# Altium schematic sheet MCU.SchDoc
size A4; SheetNumber: 2; SheetTotal: 5
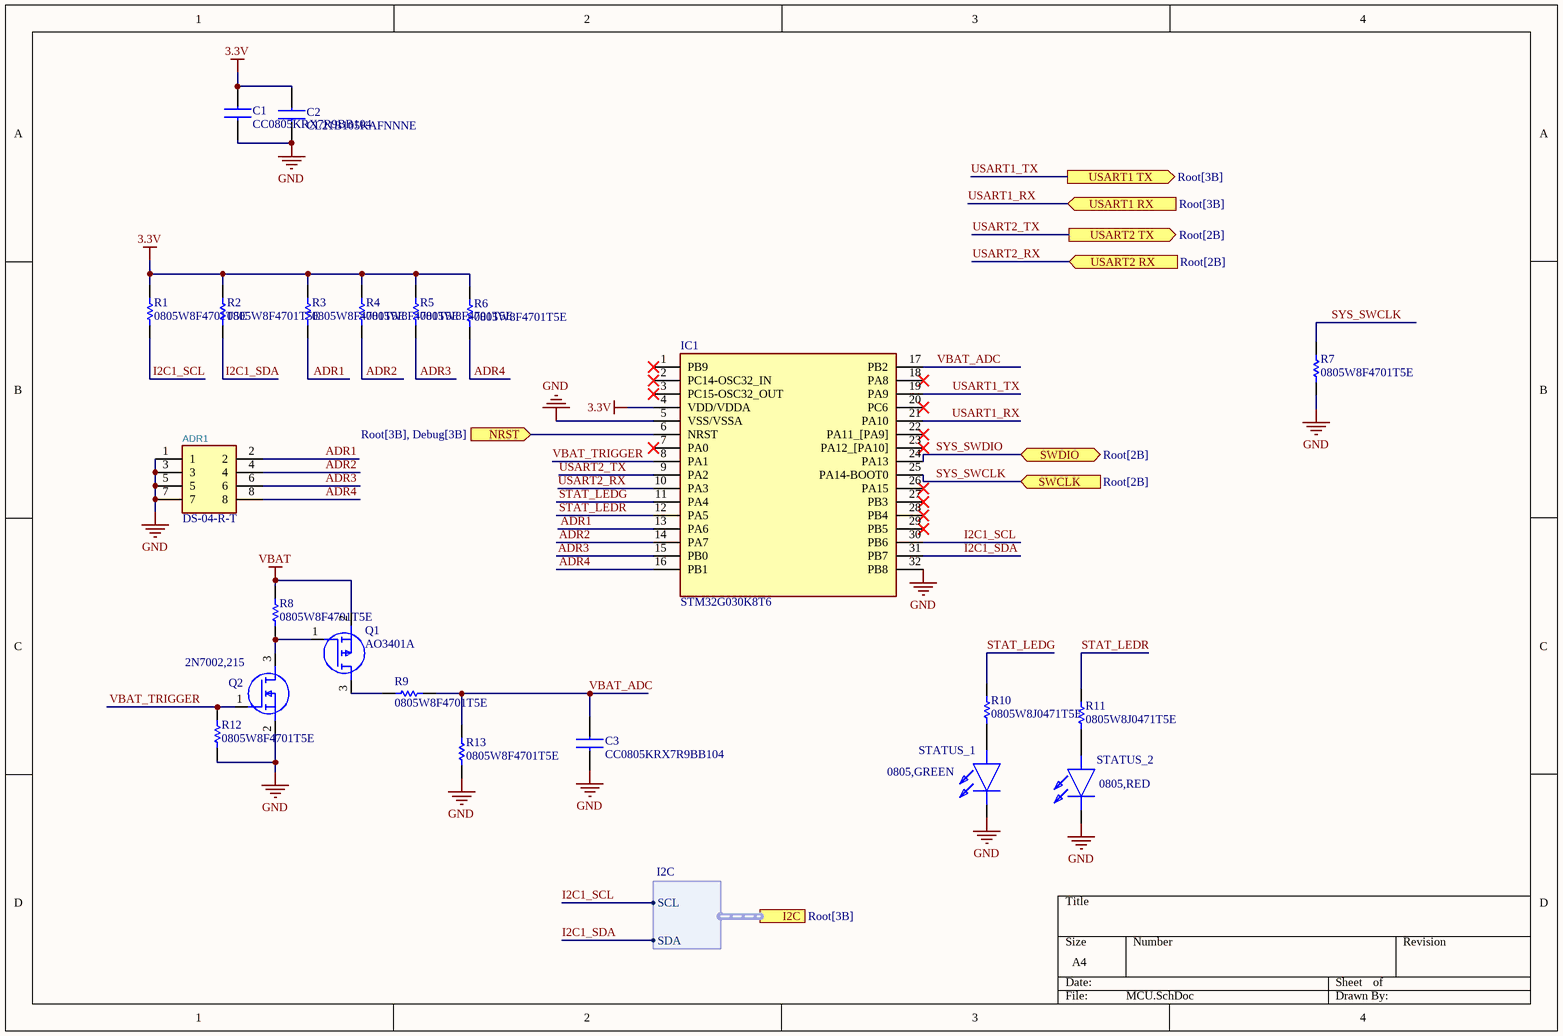
[diagram p0: MCU.SchDoc]

## Parts
ADR1  DS-04-R-T  [DS-04-R-T]
C1  CC0805KRX7R9BB104  [CAPC2012X95N]
C2  CL21B105KAFNNNE  [CAPC2012X135N]
C3  CC0805KRX7R9BB104  [CAPC2012X95N]
IC1  STM32G030K8T6  [QFP80P900X900X160-32N]
Q1  AO3401A  [SOT95P280X125-3N - duplicate]
Q2  2N7002,215  [SOT95P230X110-3N]
R1  0805W8F4701T5E  [RESC2013X65N]
R2  0805W8F4701T5E  [RESC2013X65N]
R3  0805W8F4701T5E  [RESC2013X65N]
R4  0805W8F4701T5E  [RESC2013X65N]
R5  0805W8F4701T5E  [RESC2013X65N]
R6  0805W8F4701T5E  [RESC2013X65N]
R7  0805W8F4701T5E  [RESC2013X65N]
R8  0805W8F4701T5E  [RESC2013X65N]
R9  0805W8F4701T5E  [RESC2013X65N]
R10  0805W8J0471T5E  [RESC2013X65N - Duplicate]
R11  0805W8J0471T5E  [RESC2013X65N - Duplicate]
R12  0805W8F4701T5E  [RESC2013X65N]
R13  0805W8F4701T5E  [RESC2013X65N]
STATUS_1  0805,GREEN  [LEDC2012X120N]
STATUS_2  0805,RED  [LEDC2012X120N - Duplicate]

## Ports
I2C (harness I2C, see Root[3B]), NRST (in, see Root[3B], Debug[3B]), SWCLK (in, see Root[2B]), SWDIO (bidir, see Root[2B]), USART1 RX (in, see Root[3B]), USART1 TX (out, see Root[3B]), USART2 RX (in, see Root[2B]), USART2 TX (out, see Root[2B])

## Harnesses
I2C: SCL, SDA

## Nets
3.3V: C1.2 C2.1 IC1.4(VDD/VDDA) R1.2 R2.2 R3.2 R4.2 R5.2 R6.2
GND: ADR1.1 ADR1.3 ADR1.5 ADR1.7 C1.1 C2.2 C3.1 IC1.5(VSS/VSSA) IC1.32(PB8) Q2.2(S) R7.1 R12.1 R13.1 STATUS_1.1(K) STATUS_2.1(K)
VBAT: Q1.2(S) R8.2
ADR1: ADR1.2 IC1.13(PA6) R3.1
ADR2: ADR1.4 IC1.14(PA7) R4.1
ADR3: ADR1.6 IC1.15(PB0) R5.1
ADR4: ADR1.8 IC1.16(PB1) R6.1
I2C1_SCL: IC1.30(PB6) R1.1 ; port I2C.SCL
I2C1_SDA: IC1.31(PB7) R2.1 ; port I2C.SDA
NRST: IC1.6(NRST) ; port NRST
STAT_LEDG: IC1.11(PA4) R10.2
STAT_LEDR: IC1.12(PA5) R11.2
SYS_SWCLK: IC1.25(PA14-BOOT0) R7.2 ; port SWCLK
SYS_SWDIO: IC1.24(PA13) ; port SWDIO
USART1_RX: IC1.21(PA10) ; port USART1 RX
USART1_TX: IC1.19(PA9) ; port USART1 TX
USART2_RX: IC1.10(PA3) ; port USART2 RX
USART2_TX: IC1.9(PA2) ; port USART2 TX
VBAT_ADC: C3.2 IC1.17(PB2) R9.1 R13.2
VBAT_TRIGGER: IC1.8(PA1) Q2.1(G) R12.2
NetQ1_1: Q1.1(G) Q2.3(D) R8.1
NetQ1_3: Q1.3(D) R9.2
NetR10_1: R10.1 STATUS_1.2(A)
NetR11_1: R11.1 STATUS_2.2(A)

Not connected (* = marked no-connect by the designer): IC1 1(PB9)* 2(PC14-OSC32_IN)* 3(PC15-OSC32_OUT)* 7(PA0)* 18(PA8)* 20(PC6)* 22(PA11_[PA9])* 23(PA12_[PA10])* 26(PA15)* 27(PB3)* 28(PB4)* 29(PB5)*

## Library data of the parts
ADR1 = DS-04-R-T: -30℃~+85℃ 2.54mm 24V 25mA 3,000 Cycles 4 Red SPST Slide, Rocked Plugin,P=2.54mm DIP Switches ROHS; Manufacturer: kangshen; Footprint: JLCImport:DS-04-R-T; LCSC Part #: C5123702; Manu Part #: DS-04-R-T
C1 C3 = CC0805KRX7R9BB104: 100nF, 0805, X7R; Manufacturer_Name: Yageo Group; LCSC Part #: C49678; Manu Part #: CC0805KRX7R9BB104
C2 = CL21B105KAFNNNE: 1uF, 0805, X7R; Manufacturer_Name: SAMSUNG; Manu Part #: CL21B105KBFNNNE; LCSC Part #: C28323
IC1 = STM32G030K8T6: -40℃~+85℃ 12bit 2V~3.6V 30 32 Bit 64KB 64MHz 8KB ARM Cortex-M0+ Built-in+External FLASH LQFP-32(7x7) Microcontrollers (MCU/MPU/SOC) ROHS; Manufacturer_Name: STMicroelectronics; LCSC Part #: C431631; Manu Part #: STM32G030K8T6
Q1 = AO3401A: PMOS 4.2A SOT-23; LCSC Part #: C21266; Manu Part #: AO3401A
Q2 = 2N7002,215: MOSFET (N-Channel); Manufacturer_Name: Nexperia; LCSC Part #: C65189; Manu Part #: 2N7002,215
R1-R9 R12 R13 = 0805W8F4701T5E: 4.7k 0805 1%; Manufacturer_Name: UNI-ROYAL(Uniroyal Elec); LCSC Part #: C17673; Manu Part #: 0805W8F4701T5E
R10 R11 = 0805W8J0471T5E: 470, 0805, 5%; Manufacturer_Name: ROYALOHM; Manu Part #: 0805W8F4700T5E; LCSC Part #: C17710
STATUS_1 = LTST-C170GKT: Green 569nm LED Indication - Discrete 2.1V 0805 (2012 Metric); Manufacturer_Name: Lite-On; Height: 1.2mm; Datasheet Link: https://mm.digikey.com/Volume0/opasdata/d220001/medias/docus/895/LTST-C170GKT.pdf; Manufacturer_Part_Number: LTST-C170GKT; Mouser Part Number: 859-LTST-C170GKT; Mouser Price/Stock: https://www.mouser.co.uk/ProductDetail/LITEON/LTST-C170GKT?qs=%2FSqKn2EfXQSV5aRij3YIfQ%3D%3D; Arrow Part Number: LTST-C170GKT; Arrow Price/Stock: https://www.arrow.com/en/products/ltst-c170gkt/lite-on-technology?utm_currency=USD&region=nac; Manu Part #: LTST-C170GKT; LCSC Part #: C125090
STATUS_2 = LTST-C170KRKT: Red 631nm LED Indication - Discrete 2V 0805 (2012 Metric); Manufacturer_Name: Lite-On; Datasheet Link: https://componentsearchengine.com/Datasheets/1/LTST-C170KRKT.pdf; Height: 1.2mm; Manufacturer_Part_Number: LTST-C170KRKT; Mouser Part Number: 859-LTST-C170KRKT; Mouser Price/Stock: https://www.mouser.co.uk/ProductDetail/LITEON/LTST-C170KRKT?qs=NUb82WqeCyrVOID%2Fxt4rgA%3D%3D; Arrow Part Number: LTST-C170KRKT; Arrow Price/Stock: https://www.arrow.com/en/products/ltst-c170krkt/lite-on-technology?utm_currency=USD&region=nac; Manu Part #: LTST-C170KRKT; LCSC Part #: C94868